# Altium schematic sheet [3]DotexBoard_Interfaces.SchDoc
size B
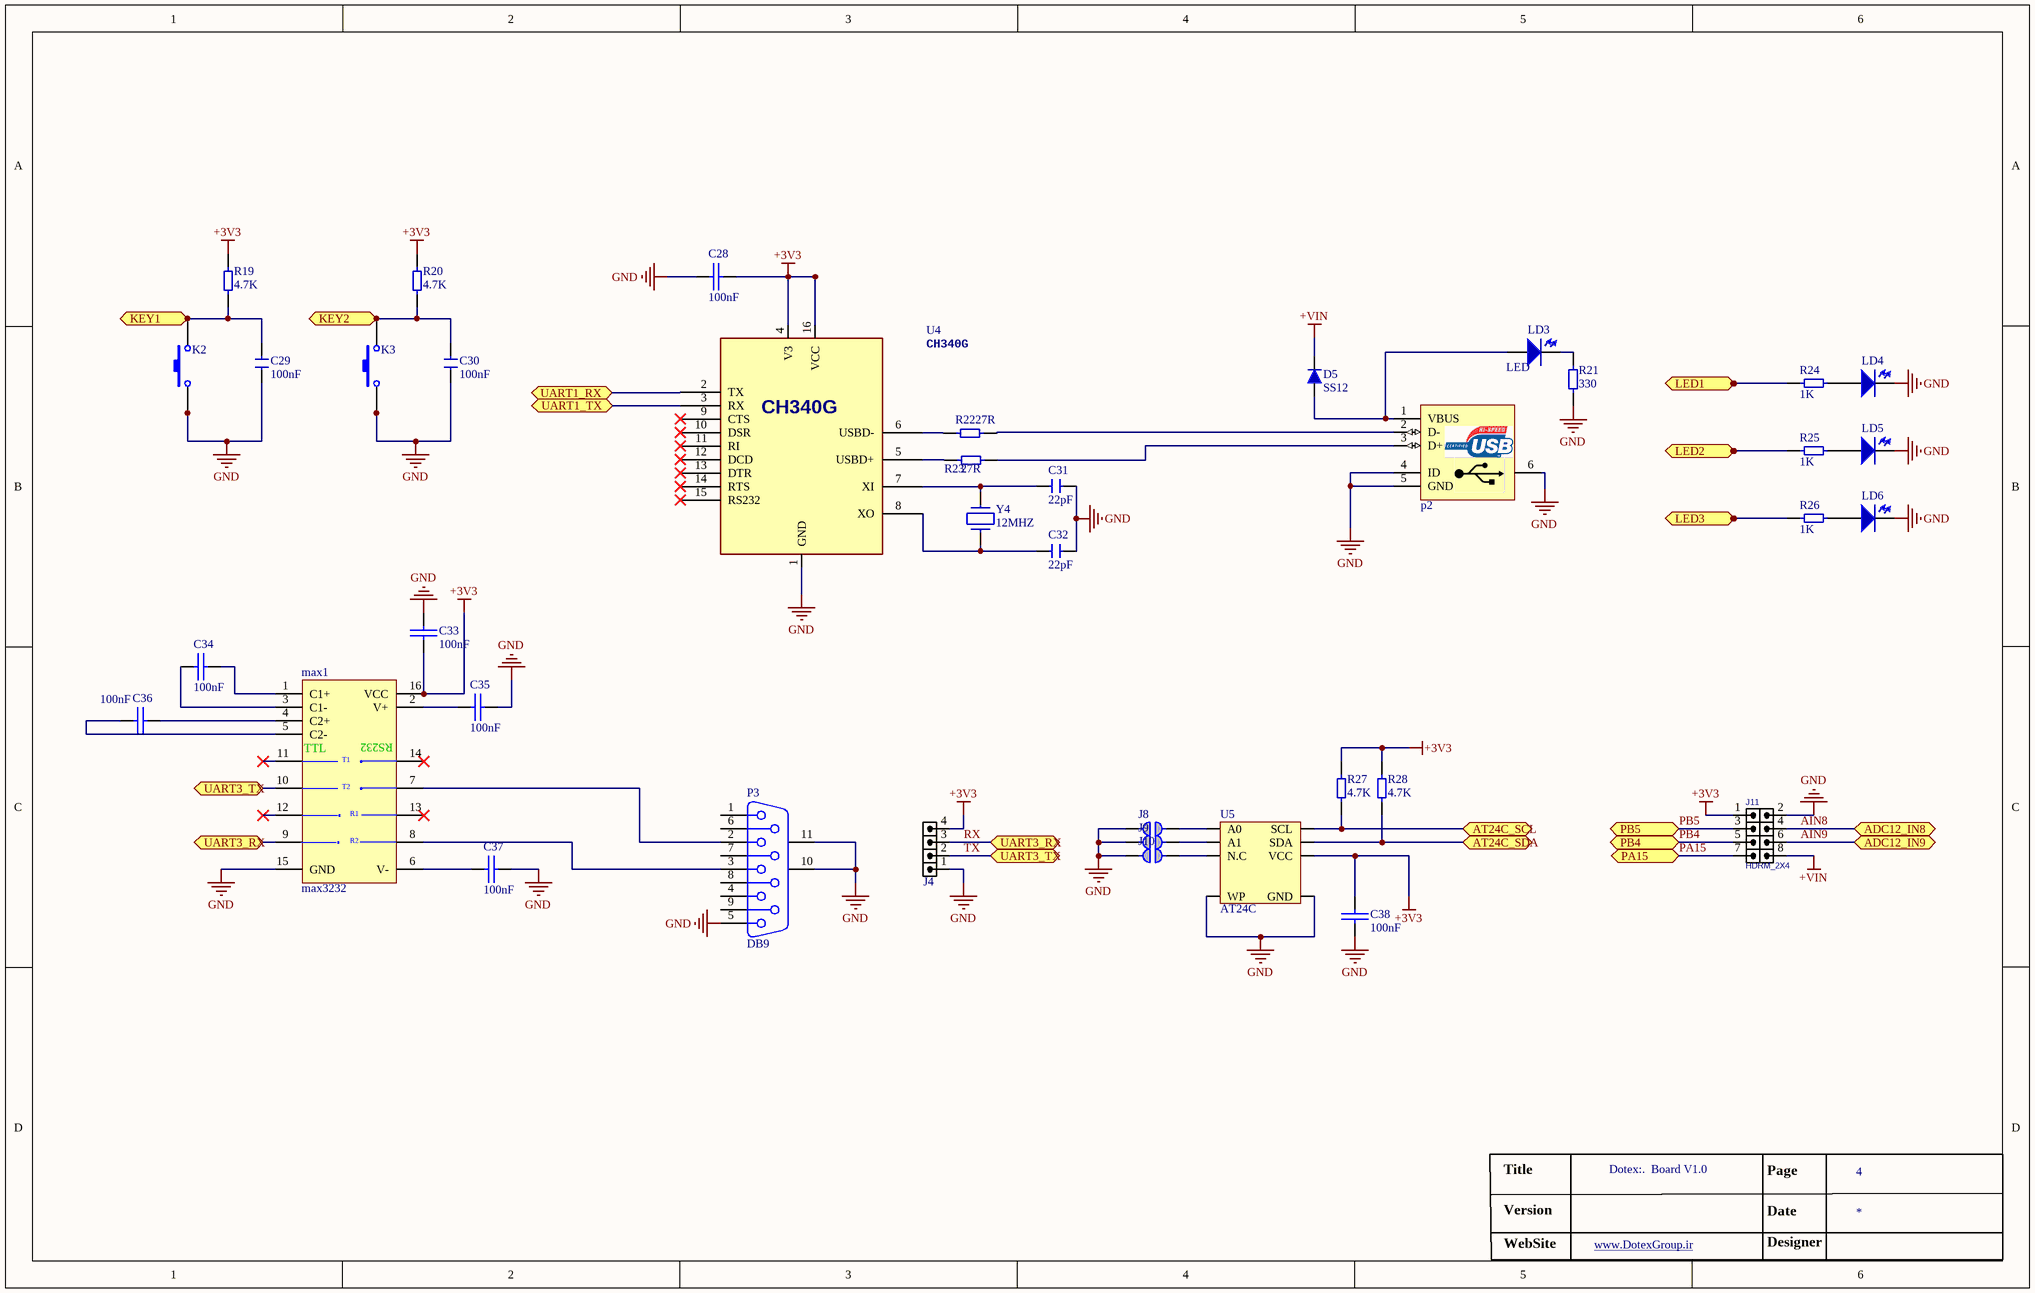
[diagram p0: [3]DotexBoard_Interfaces.SchDoc]

## Parts
C28  value 100nF  [0805 Capacitor]  (hidden comment: Comment)
C29  Comment  [0805 Capacitor]  (value not drawn)
C30  Comment  [0805 Capacitor]  (value not drawn)
C31  Comment  [0805 Capacitor]  (value not drawn)
C32  Comment  [0805 Capacitor]  (value not drawn)
C33  value 100nF  [0805 Capacitor]  (hidden comment: Comment)
C34  value 100nF  [0805 Capacitor]  (hidden comment: Comment)
C35  value 100nF  [0805 Capacitor]  (hidden comment: Comment)
C36  value 100nF  [0805 Capacitor]  (hidden comment: Comment)
C37  value 100nF  [0805 Capacitor]  (hidden comment: Comment)
C38  value 100nF  [0805 Capacitor]  (hidden comment: Comment)
D5  SS12  [DO-214AC(SMA)]
J4  HDR1X4  [HDR_M_1X4]  (value not drawn)
J8  Comment  [0603 Resistor]  (value not drawn)
J9  Comment  [0603 Resistor]  (value not drawn)
J10  Comment  [0603 Resistor]  (value not drawn)
J11  HDRM_2X4  [HDR_M_2X4]
K2  Comment  [Push Kay 4 KFC]  (value not drawn)
K3  Comment  [Push Kay 4 KFC]  (value not drawn)
LD3  LED  [LED_0805 Y]
LD4  Comment  [LED_0805 Y]  (value not drawn)
LD5  Comment  [LED_0805 Y]  (value not drawn)
LD6  Comment  [LED_0805 Y]  (value not drawn)
max1  max3232  [SO-16]
p2  USB Connector  [USB_AB_BM_SHS]  (value not drawn)
P3  DB9  [DB9 Female]
R19  Comment  [0805 Resistor]  (value not drawn)
R20  Comment  [0805 Resistor]  (value not drawn)
R21  Comment  [0805 Resistor]  (value not drawn)
R22  Comment  [0805 Resistor]  (value not drawn)
R23  Comment  [0805 Resistor]  (value not drawn)
R24  Comment  [0805 Resistor]  (value not drawn)
R25  Comment  [0805 Resistor]  (value not drawn)
R26  Comment  [0805 Resistor]  (value not drawn)
R27  Comment  [0805 Resistor]  (value not drawn)
R28  Comment  [0805 Resistor]  (value not drawn)
U4  CH340G  [SO-16]
U5  AT24C  [SOIC-8]
Y4  12MHZ  [Xtal 2p]

## Ports
ADC12_IN8 (bidir), ADC12_IN9 (bidir), AT24C_SCL (bidir), AT24C_SDA (bidir), KEY1 (bidir), KEY2 (bidir), LED1 (bidir), LED2 (bidir), LED3 (bidir), PA15 (bidir), PB4 (bidir), PB5 (bidir), UART1_RX (bidir), UART1_TX (bidir), UART3_RX (bidir), UART3_TX (bidir)

## Nets
+3V3: C28.2(-) C33.1(+) C38.1(+) J4.4 J11.1 max1.16(VCC) R19.1 R20.1 R27.1 R28.1 U4.4(V3) U4.16(VCC) U5.8(VCC)
+VIN: D5.2(K) J11.8
GND: C28.1(+) C29.2 C30.2 C31.1 C32.2 C33.2(-) C35.2(-) C37.2(-) C38.2(-) J4.1 J8.1 J9.1 J10.1 J11.2 K2.1 K3.1 LD4.2(K) LD5.2(K) LD6.2(K) max1.15(GND) p2.4(ID) p2.5(GND) p2.6(MH) P3.5 P3.10(MH1) P3.11(MH2) R21.2 U4.1(GND) U5.4(GND) U5.7(WP)
AIN8: J11.4 ; port ADC12_IN8
AIN9: J11.6 ; port ADC12_IN9
AT24C_SCL: R27.2 U5.6(SCL) ; port AT24C_SCL
AT24C_SDA: R28.2 U5.5(SDA) ; port AT24C_SDA
KEY1: C29.1 K2.2 R19.2 ; port KEY1
KEY2: C30.1 K3.2 R20.2 ; port KEY2
LED1: R24.1 ; port LED1
LED2: R25.1 ; port LED2
LED3: R26.1 ; port LED3
PA15: J11.7 ; port PA15
PB4: J11.5 ; port PB4
PB5: J11.3 ; port PB5
RX: J4.3 max1.9(R2OUT) ; port UART3_RX
TX: J4.2 max1.10(T2IN) ; port UART3_TX
UART1_RX: U4.2(TX) ; port UART1_RX
UART1_TX: U4.3(RX) ; port UART1_TX
NetC31_2: C31.2 U4.7(XI) Y4.2
NetC32_1: C32.1 U4.8(XO) Y4.1
NetC34_1: C34.1(+) max1.1(C1+)
NetC34_2: C34.2(-) max1.3(C1-)
NetC35_1: C35.1(+) max1.2(V+)
NetC36_1: C36.1(+) max1.5(C2-)
NetC36_2: C36.2(-) max1.4(C2+)
NetC37_1: C37.1(+) max1.6(V-)
NetD5_1: D5.1(A) LD3.1(A) p2.1(VBUS)
NetJ8_2: J8.2 U5.1(A0)
NetJ9_2: J9.2 U5.2(A1)
NetJ10_2: J10.2 U5.3(N.C)
NetLD3_2: LD3.2(K) R21.1
NetLD4_1: LD4.1(A) R24.2
NetLD5_1: LD5.1(A) R25.2
NetLD6_1: LD6.1(A) R26.2
Netmax1_7: max1.7(T2OUT) P3.2
Netmax1_8: max1.8(R2IN) P3.3
Netp2_2: p2.2(D-) R22.2
Netp2_3: p2.3(D+) R23.2
NetR22_1: R22.1 U4.6(USBD-)
NetR23_1: R23.1 U4.5(USBD+)

Not connected (* = marked no-connect by the designer): max1 11(T1IN)* 12(R1OUT)* 13(R1IN)* 14(T1OUT)*; P3 1 4 6 7 8 9; U4 9(CTS)* 10(DSR)* 11(RI)* 12(DCD)* 13(DTR)* 14(RTS)* 15(RS232)*

## Notes on the sheet
- Title
- Dotex:.  Board V1.0
- Page
- 4
- Version
- WebSite
- www.DotexGroup.ir <http://www.DotexGwww.DotexGroup.irroup.ir>
- Date
- Designer
- (in symbol Capacitor SMD) 100nF; 22pF
- (in symbol MAX232) TTL; RS232; T1; T2; R1; R2
- (in symbol Resistor SMD) 4.7K; 330; 27R; 1K

## Library data of the parts
C28 C33-C38 = Cap-Bipolar: Bipolar Capacitor; Voltage: 100V; Designer: Saeid Jorablo; Organazation: ControTec; Adding Date: 1387/12/20
C29-C32 = Capacitor SMD
D5 = 1N4001
J4 = HDR_M_1X4: CONN, HEADER, Male, pitch: 2.54mm, 4POS; VALUE: HDRM4
J8-J10 = jumper SMD
J11 = HDR_M_2X4: CONN, HEADER, Male, pitch: 2.54mm, 8POS; MANF_P#: MANF_PART#; MANF: MANF; VALUE: HDRM_2X4
K2 K3 = Push Kay
LD3-LD6 = LED SMD
max1 = MAX232: +5V Powered, Multi-Channel RS-232 Driver/Receiver; ComponentAuthor: Saeid Jorablo; ComponentLink1Description: Datasheet; ComponentLink1URL: http://pdfserv.maxim-ic.com/en/ds/MAX220-MAX249.pdf
p2 = USB AB MICRO CONNECTOR: USB MICRO-B Type Connector; Designer: ABBAS BASEREH; Max Current: 1600mA; Mounting Technology: Surface Mount\Through-Hole; Category: Connector; Pin Count: 5-7; Publisher: ABBAS BASEREH; Status: Unreleased; ComponentLink1Description: Datasheet; ComponentLink2Description: Reference; Update: 1395-11-17
P3 = DB9 Connector: Receptacle Assembly, 9 Position, Right Angle; PackageDocument: O; Positions: 9; Published: 15-Jun-2001; LatestRevisionDate: 17-Jul-2002; LatestRevisionNote: Re-released for DXP Platform.; DatasheetDocument: 1-Sep-1999; PackageReference: 788750; Publisher: Altium Limited; Orientation: Right Angle; Gender: Receptacle
R19-R28 = Resistor SMD
U4 = CH340G_SOP16: USB-UART; MANF_P#: CH340G; VALUE: CH340G
U5 = AT24C128
Y4 = Xtal